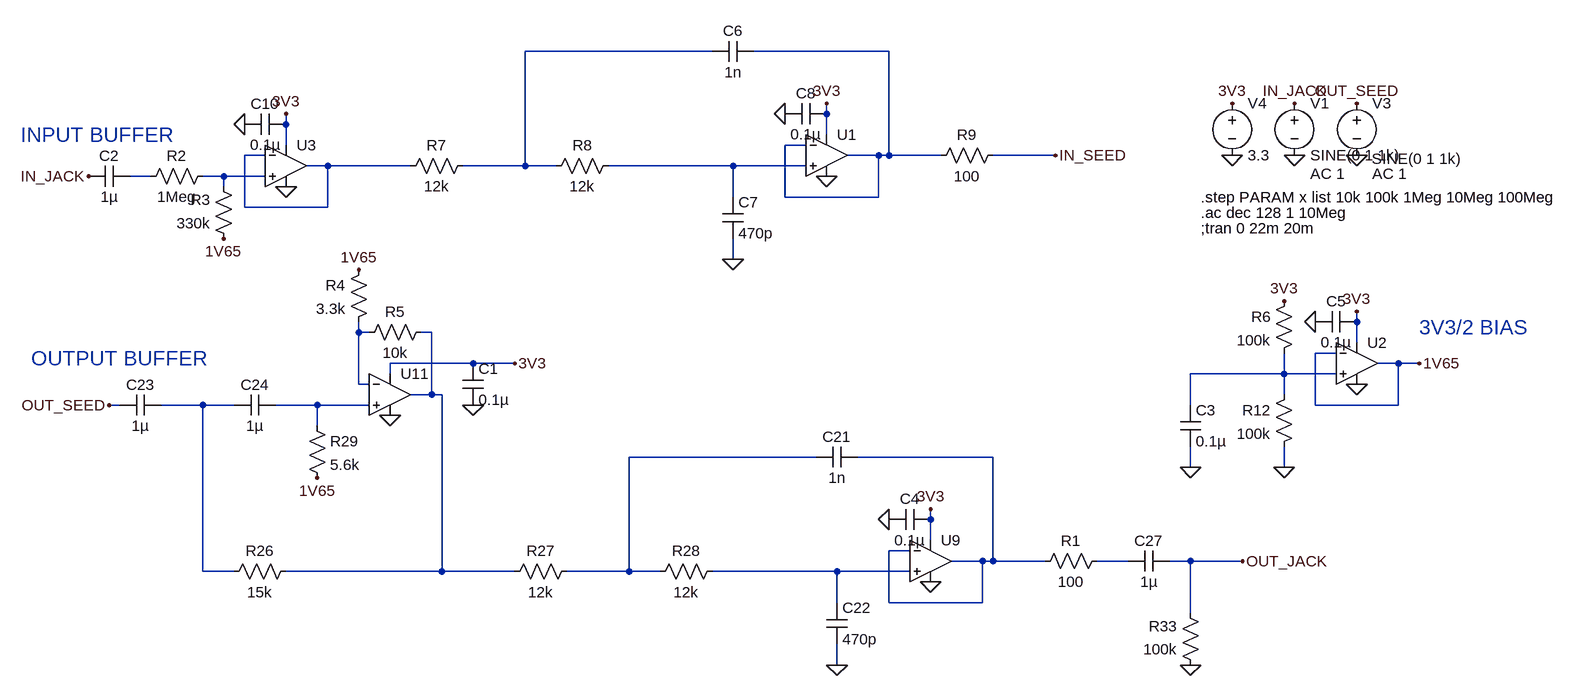
[diagram p0: schematic ff_buffer.asc]
ff_buffer.asc, the LTspice schematic file:
Version 4
SHEET 1 5352 2548
WIRE 1936 1584 1648 1584
WIRE 2208 1584 2000 1584
WIRE 2112 1680 2112 1664
WIRE 1280 1696 1280 1680
WIRE 2112 1712 2112 1680
WIRE 1280 1728 1280 1696
WIRE 2080 1728 2048 1728
WIRE 1248 1744 1216 1744
WIRE 2192 1744 2144 1744
WIRE 2208 1744 2208 1584
WIRE 2208 1744 2192 1744
WIRE 2288 1744 2208 1744
WIRE 2464 1744 2368 1744
WIRE 1344 1760 1312 1760
WIRE 1472 1760 1344 1760
WIRE 1648 1760 1648 1584
WIRE 1648 1760 1552 1760
WIRE 1696 1760 1648 1760
WIRE 1968 1760 1776 1760
WIRE 2080 1760 1968 1760
WIRE 1072 1776 1040 1776
WIRE 1184 1776 1152 1776
WIRE 1248 1776 1184 1776
WIRE 1184 1792 1184 1776
WIRE 1968 1808 1968 1760
WIRE 2048 1808 2048 1728
WIRE 2192 1808 2192 1744
WIRE 2192 1808 2048 1808
WIRE 1216 1824 1216 1744
WIRE 1344 1824 1344 1760
WIRE 1344 1824 1216 1824
WIRE 1968 1904 1968 1872
WIRE 2928 2000 2928 1984
WIRE 1392 2016 1392 2000
WIRE 1408 2016 1392 2016
WIRE 1504 2016 1488 2016
WIRE 2928 2032 2928 2000
WIRE 2896 2048 2864 2048
WIRE 1568 2064 1440 2064
WIRE 1632 2064 1568 2064
WIRE 2992 2064 2960 2064
WIRE 3024 2064 2992 2064
WIRE 1440 2080 1440 2064
WIRE 2816 2080 2816 2048
WIRE 2816 2080 2672 2080
WIRE 2896 2080 2816 2080
WIRE 1392 2096 1392 2016
WIRE 1408 2096 1392 2096
WIRE 1504 2112 1504 2016
WIRE 1504 2112 1472 2112
WIRE 1520 2112 1504 2112
WIRE 2816 2112 2816 2080
WIRE 1024 2128 1008 2128
WIRE 1152 2128 1088 2128
WIRE 1200 2128 1152 2128
WIRE 1328 2128 1264 2128
WIRE 1408 2128 1328 2128
WIRE 2672 2128 2672 2080
WIRE 2864 2128 2864 2048
WIRE 2992 2128 2992 2064
WIRE 2992 2128 2864 2128
WIRE 1328 2160 1328 2128
WIRE 2096 2208 1808 2208
WIRE 2368 2208 2160 2208
WIRE 2672 2224 2672 2192
WIRE 2816 2224 2816 2192
WIRE 2272 2304 2272 2288
WIRE 2272 2336 2272 2304
WIRE 2240 2352 2208 2352
WIRE 2352 2368 2304 2368
WIRE 2368 2368 2368 2208
WIRE 2368 2368 2352 2368
WIRE 2448 2368 2368 2368
WIRE 2576 2368 2528 2368
WIRE 2672 2368 2640 2368
WIRE 2752 2368 2672 2368
WIRE 1152 2384 1152 2128
WIRE 1200 2384 1152 2384
WIRE 1520 2384 1520 2112
WIRE 1520 2384 1280 2384
WIRE 1632 2384 1520 2384
WIRE 1808 2384 1808 2208
WIRE 1808 2384 1712 2384
WIRE 1856 2384 1808 2384
WIRE 2128 2384 1936 2384
WIRE 2240 2384 2128 2384
WIRE 2128 2432 2128 2384
WIRE 2208 2432 2208 2352
WIRE 2352 2432 2352 2368
WIRE 2352 2432 2208 2432
WIRE 2672 2448 2672 2368
WIRE 2128 2528 2128 2496
FLAG 2832 1744 0
FLAG 2832 1664 IN_JACK
FLAG 2928 1744 0
FLAG 2928 1664 OUT_SEED
FLAG 2128 2528 0
FLAG 2272 2400 0
FLAG 1440 2144 0
FLAG 2672 2528 0
FLAG 2816 1968 3V3
FLAG 3024 2064 1V65
FLAG 2672 2224 0
FLAG 2928 2096 0
FLAG 2736 1744 0
FLAG 2736 1664 3V3
FLAG 1328 2240 1V65
FLAG 1392 1920 1V65
FLAG 1280 1792 0
FLAG 1184 1872 1V65
FLAG 1280 1680 3V3
FLAG 1216 1696 0
FLAG 1632 2064 3V3
FLAG 1568 2128 0
FLAG 2272 2288 3V3
FLAG 2208 2304 0
FLAG 1008 2128 OUT_SEED
FLAG 2752 2368 OUT_JACK
FLAG 976 1776 IN_JACK
FLAG 2464 1744 IN_SEED
FLAG 2816 2224 0
FLAG 2928 1984 3V3
FLAG 2864 2000 0
FLAG 1968 1904 0
FLAG 2112 1776 0
FLAG 2112 1664 3V3
FLAG 2048 1680 0
SYMBOL voltage 2928 1648 R0
WINDOW 123 24 124 Left 2
WINDOW 39 0 0 Left 0
WINDOW 3 23 101 Left 2
SYMATTR Value2 AC 1
SYMATTR Value SINE(0 1 1k)
SYMATTR InstName V3
SYMBOL res 1728 2368 R90
WINDOW 0 0 56 VBottom 2
WINDOW 3 32 56 VTop 2
SYMATTR InstName R27
SYMATTR Value 12k
SYMBOL res 1952 2368 R90
WINDOW 0 0 56 VBottom 2
WINDOW 3 32 56 VTop 2
SYMATTR InstName R28
SYMATTR Value 12k
SYMBOL cap 2160 2192 R90
WINDOW 0 0 32 VBottom 2
WINDOW 3 32 32 VTop 2
SYMATTR InstName C21
SYMATTR Value 1n
SYMBOL cap 2112 2432 R0
SYMATTR InstName C22
SYMATTR Value 470p
SYMBOL OpAmps\\UniversalOpAmp2 2272 2368 R0
SYMATTR InstName U9
SYMATTR Value2 Avol=1Meg GBW=1Meg Slew=10Meg
SYMBOL cap 1088 2112 R90
WINDOW 0 0 32 VBottom 2
WINDOW 3 32 32 VTop 2
SYMATTR InstName C23
SYMATTR Value 1µ
SYMBOL cap 1264 2112 R90
WINDOW 0 0 32 VBottom 2
WINDOW 3 32 32 VTop 2
SYMATTR InstName C24
SYMATTR Value 1µ
SYMBOL res 1296 2368 R90
WINDOW 0 0 56 VBottom 2
WINDOW 3 32 56 VTop 2
SYMATTR InstName R26
SYMATTR Value 15k
SYMBOL OpAmps\\UniversalOpAmp2 1440 2112 R0
SYMATTR InstName U11
SYMBOL res 1312 2144 R0
SYMATTR InstName R29
SYMATTR Value 5.6k
SYMBOL res 2688 2544 R180
WINDOW 0 36 76 Left 2
WINDOW 3 36 40 Left 2
SYMATTR InstName R33
SYMATTR Value 100k
SYMBOL cap 2640 2352 R90
WINDOW 0 0 32 VBottom 2
WINDOW 3 32 32 VTop 2
SYMATTR InstName C27
SYMATTR Value 1µ
SYMBOL res 2832 2096 M0
SYMATTR InstName R12
SYMATTR Value 100k
SYMBOL cap 2656 2128 R0
SYMATTR InstName C3
SYMATTR Value 0.1µ
SYMBOL OpAmps\\UniversalOpAmp2 2928 2064 R0
SYMATTR InstName U2
SYMBOL res 2544 2352 R90
WINDOW 0 0 56 VBottom 2
WINDOW 3 32 56 VTop 2
SYMATTR InstName R1
SYMATTR Value 100
SYMBOL voltage 2736 1648 R0
SYMATTR InstName V4
SYMATTR Value 3.3
SYMBOL res 1408 1904 M0
SYMATTR InstName R4
SYMATTR Value 3.3k
SYMBOL cap 1040 1760 R90
WINDOW 0 0 32 VBottom 2
WINDOW 3 32 32 VTop 2
SYMATTR InstName C2
SYMATTR Value 1µ
SYMBOL res 1168 1760 R90
WINDOW 0 0 56 VBottom 2
WINDOW 3 32 56 VTop 2
SYMATTR InstName R2
SYMATTR Value 1Meg
SYMBOL res 1200 1888 R180
WINDOW 0 36 76 Left 2
WINDOW 3 36 40 Left 2
SYMATTR InstName R3
SYMATTR Value 330k
SYMBOL OpAmps\\UniversalOpAmp2 1280 1760 R0
SYMATTR InstName U3
SYMATTR Value2 Avol=1Meg GBW=1Meg Slew=10Meg
SYMBOL cap 1280 1680 R90
WINDOW 0 0 32 VBottom 2
WINDOW 3 32 32 VTop 2
SYMATTR InstName C10
SYMATTR Value 0.1µ
SYMBOL voltage 2832 1648 R0
WINDOW 123 24 124 Left 2
WINDOW 39 0 0 Left 0
SYMATTR InstName V1
SYMATTR Value SINE(0 1 1k)
SYMATTR Value2 AC 1
SYMBOL res 1504 2000 R90
WINDOW 0 0 56 VBottom 2
WINDOW 3 32 56 VTop 2
SYMATTR InstName R5
SYMATTR Value 10k
SYMBOL cap 1552 2064 R0
SYMATTR InstName C1
SYMATTR Value 0.1µ
SYMBOL cap 2272 2288 R90
WINDOW 0 0 32 VBottom 2
WINDOW 3 32 32 VTop 2
SYMATTR InstName C4
SYMATTR Value 0.1µ
SYMBOL res 2832 1952 M0
SYMATTR InstName R6
SYMATTR Value 100k
SYMBOL cap 2928 1984 R90
WINDOW 0 0 32 VBottom 2
WINDOW 3 32 32 VTop 2
SYMATTR InstName C5
SYMATTR Value 0.1µ
SYMBOL res 1568 1744 R90
WINDOW 0 0 56 VBottom 2
WINDOW 3 32 56 VTop 2
SYMATTR InstName R7
SYMATTR Value 12k
SYMBOL res 1792 1744 R90
WINDOW 0 0 56 VBottom 2
WINDOW 3 32 56 VTop 2
SYMATTR InstName R8
SYMATTR Value 12k
SYMBOL cap 2000 1568 R90
WINDOW 0 0 32 VBottom 2
WINDOW 3 32 32 VTop 2
SYMATTR InstName C6
SYMATTR Value 1n
SYMBOL cap 1952 1808 R0
SYMATTR InstName C7
SYMATTR Value 470p
SYMBOL OpAmps\\UniversalOpAmp2 2112 1744 R0
SYMATTR InstName U1
SYMATTR Value2 Avol=1Meg GBW=1Meg Slew=10Meg
SYMBOL res 2384 1728 R90
WINDOW 0 0 56 VBottom 2
WINDOW 3 32 56 VTop 2
SYMATTR InstName R9
SYMATTR Value 100
SYMBOL cap 2112 1664 R90
WINDOW 0 0 32 VBottom 2
WINDOW 3 32 32 VTop 2
SYMATTR InstName C8
SYMATTR Value 0.1µ
TEXT 2688 1856 Left 2 !;tran 0 22m 20m
TEXT 2688 1832 Left 2 !.ac dec 128 1 10Meg
TEXT 2688 1808 Left 2 !.step PARAM x list 10k 100k 1Meg 10Meg 100Meg
TEXT 872 1712 Left 3 ;INPUT BUFFER
TEXT 888 2056 Left 3 ;OUTPUT BUFFER
TEXT 3024 2008 Left 3 ;3V3/2 BIAS

The netlist it stands for:
* ff_buffer.asc
V3 OUT_SEED 0 SINE(0 1 1k) AC 1
R27 N012 N008 12k
R28 N015 N012 12k
C21 N013 N012 1n
C22 N015 0 470p
XU9 N015 N013 3V3 0 N013 level2 Avol=1Meg GBW=1Meg Slew=10Meg Ilimit=25m Rail=0 Vos=0 En=0 Enk=0 In=0 Ink=0 Rin=500Meg  ; pins In+ In- V+ V- OUT
C23 N010 OUT_SEED 1µ
C24 N011 N010 1µ
R26 N008 N010 15k
XU11 N011 N007 3V3 0 N008 level2 Avol=1Meg GBW=10Meg Slew=10Meg Ilimit=25m Rail=0 Vos=0 En=0 Enk=0 In=0 Ink=0 Rin=500Meg  ; pins In+ In- V+ V- OUT
R29 N011 1V65 5.6k
R33 0 OUT_JACK 100k
C27 OUT_JACK N014 1µ
R12 N009 0 100k
C3 N009 0 0.1µ
XU2 N009 1V65 3V3 0 1V65 level2 Avol=1Meg GBW=10Meg Slew=10Meg Ilimit=25m Rail=0 Vos=0 En=0 Enk=0 In=0 Ink=0 Rin=500Meg  ; pins In+ In- V+ V- OUT
R1 N014 N013 100
V4 3V3 0 3.3
R4 1V65 N007 3.3k
C2 N005 IN_JACK 1µ
R2 N006 N005 1Meg
R3 1V65 N006 330k
XU3 N006 N003 3V3 0 N003 level2 Avol=1Meg GBW=1Meg Slew=10Meg Ilimit=25m Rail=0 Vos=0 En=0 Enk=0 In=0 Ink=0 Rin=500Meg  ; pins In+ In- V+ V- OUT
C10 3V3 0 0.1µ
V1 IN_JACK 0 SINE(0 1 1k) AC 1
R5 N008 N007 10k
C1 3V3 0 0.1µ
C4 3V3 0 0.1µ
R6 3V3 N009 100k
C5 3V3 0 0.1µ
R7 N001 N003 12k
R8 N004 N001 12k
C6 N002 N001 1n
C7 N004 0 470p
XU1 N004 N002 3V3 0 N002 level2 Avol=1Meg GBW=1Meg Slew=10Meg Ilimit=25m Rail=0 Vos=0 En=0 Enk=0 In=0 Ink=0 Rin=500Meg  ; pins In+ In- V+ V- OUT
R9 IN_SEED N002 100
C8 3V3 0 0.1µ
;tran 0 22m 20m
.ac dec 128 1 10Meg
.step PARAM x list 10k 100k 1Meg 10Meg 100Meg
* INPUT BUFFER
* OUTPUT BUFFER
* 3V3/2 BIAS
.lib UniversalOpAmp2.lib
.backanno
.end